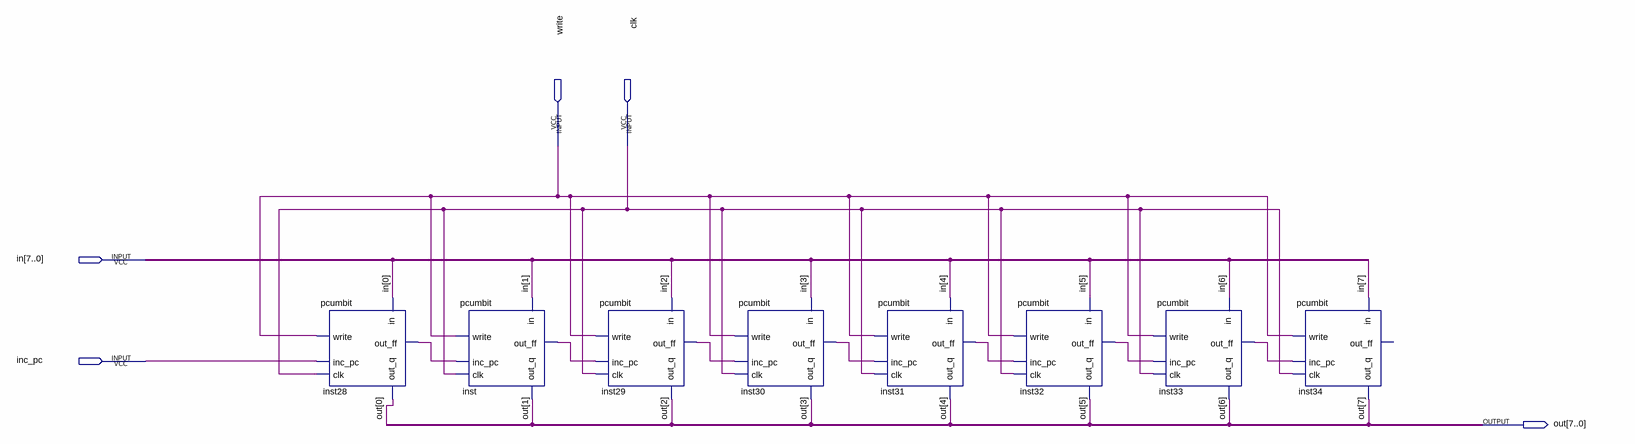
[diagram p0: schematic sheet]
// Quartus schematic pc.bdf as structural Verilog: 8 symbols, 5 pins
module pc (
  input  write,
  input  clk,
  input  [7:0] in,
  input  inc_pc,
  output [7:0] out
);

  wire inst28_out_ff, inst29_out_ff, inst30_out_ff, inst31_out_ff, inst32_out_ff, inst33_out_ff, inst_out_ff;

  pcumbit inst28 (.in(in[0]), .inc_pc(inc_pc), .write(write), .clk(clk), .out_q(out[0]), .out_ff(inst28_out_ff));
  pcumbit inst (.in(in[1]), .inc_pc(inst28_out_ff), .write(write), .clk(clk), .out_q(out[1]), .out_ff(inst_out_ff));
  pcumbit inst29 (.in(in[2]), .inc_pc(inst_out_ff), .write(write), .clk(clk), .out_q(out[2]), .out_ff(inst29_out_ff));
  pcumbit inst30 (.in(in[3]), .inc_pc(inst29_out_ff), .write(write), .clk(clk), .out_q(out[3]), .out_ff(inst30_out_ff));
  pcumbit inst31 (.in(in[4]), .inc_pc(inst30_out_ff), .write(write), .clk(clk), .out_q(out[4]), .out_ff(inst31_out_ff));
  pcumbit inst32 (.in(in[5]), .inc_pc(inst31_out_ff), .write(write), .clk(clk), .out_q(out[5]), .out_ff(inst32_out_ff));
  pcumbit inst33 (.in(in[6]), .inc_pc(inst32_out_ff), .write(write), .clk(clk), .out_q(out[6]), .out_ff(inst33_out_ff));
  pcumbit inst34 (.in(in[7]), .inc_pc(inst33_out_ff), .write(write), .clk(clk), .out_q(out[7]));  // open: out_ff
endmodule
